# Altium schematic sheet Output.SchDoc: Output
size A4; Date: JUN 2020; ApprovedBy: Hören; CheckedBy: Mörz; Author: Rudziński; CompanyName: Semi-ATE; DrawnBy: Rudziński; Engineer: Hören; Organization: Semi-ATE; DocumentNumber: 10; Revision: V1.0; SheetNumber: 10; SheetTotal: 20
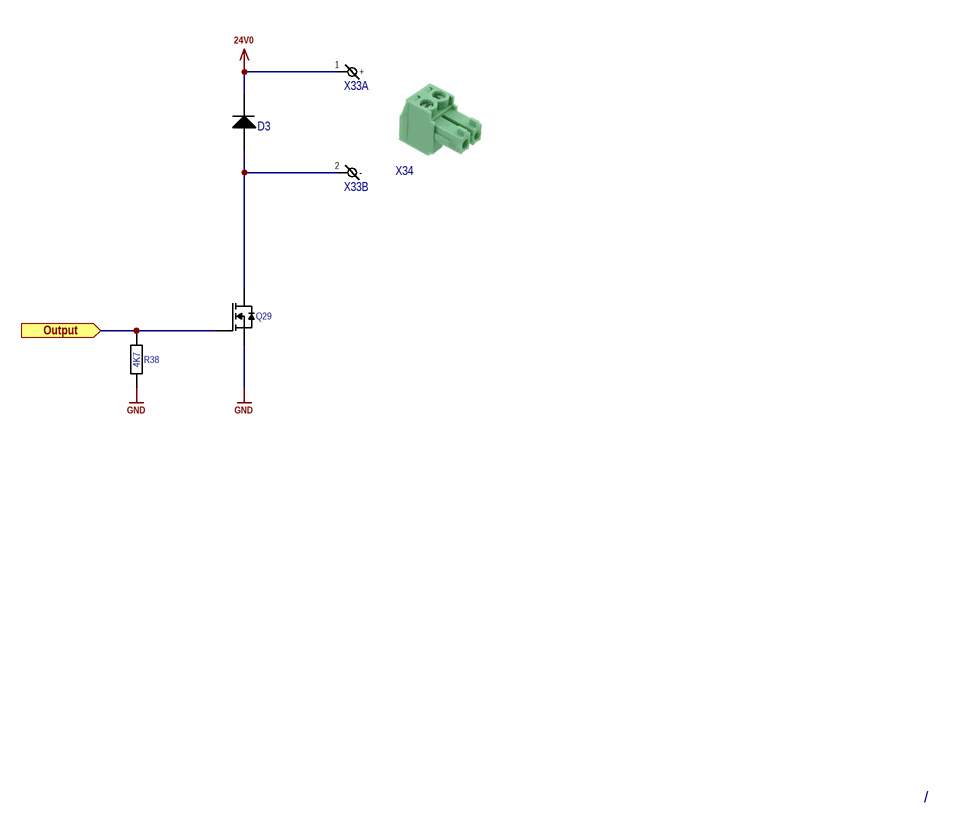
[diagram p0: Output.SchDoc]

## Parts
D3  D  [SOT23-3]  (value not drawn)
Q29  Q  [SOIC-8_MOSFET]  (value not drawn)
R38  value 4K7  [R0603 Reflow]  (hidden comment: R)
X33  X  [691322310002]  (value not drawn)  (parts A,B of 2)
X34  X  [691361300002]  (value not drawn)

## Ports
Output (in)

## Nets
24V0: D3.3(C) X33.1(+)
GND: Q29.2(S) R38.1
Output: Q29.1(G) R38.2 ; port Output
NetD3_1: D3.1(A) Q29.3(D) X33.2(-)

## Notes on the sheet
- /
- designed by
- reviewed by
- last drawn by
- Project:
- Schematic:
- last printed
- DIN-A4 L
- sheets
- of
- File:

## Library data of the parts
D3 = HSMS-2800-TR1G: DIODE SCHOTTKY 70V 70MA SOT23-3; 04. Manufacturer: ON Semiconductor; 07. Manufacturer  Part Number: BAS70LT1G; 03. Unit Price: 0.18; 13. Created Date/Name: AUG 2018 / Hören; 01. Distributor: DigiKey; 02. Distributor Part Number: BAS70LT1GOSCT-ND; ComponentLink1Description: Info; ComponentLink1URL: https://www.digikey.de/products/en/discrete-semiconductor-products/diodes-rf/284?k=HSMS-2800&k=&pkeyword=HSMS-2800&sv=0&pv7=243&sf=0&quantity=&ColumnSort=0&page=1&pageSize=25; ComponentLink2Description: DataSheet; ComponentLink2URL: https://docs.broadcom.com/docs/AV02-0533EN
Q29 = AO4266E: Transistor: N-MOSFET; unipolar; 60V; 8,5A; 2W; SO8; 04. Manufacturer: ALPHA & OMEGA SEMICONDUCTOR; 03. Unit Price: 0.242; 01. Distributor: TME; 02. Distributor Part Number: AO4266E; 07. Manufacturer  Part Number: AO4266E; 11. RoHS: YES; ComponentLink1Description: Info; ComponentLink1URL: https://www.digikey.de/product-detail/en/on-semiconductor/FDV303N/FDV303NDKR-ND/1630434; ComponentLink2Description: DataSheet; ComponentLink2URL: https://media.digikey.com/pdf/Data%20Sheets/Fairchild%20PDFs/FDV303N.pdf
R38 = R: RES SMD 4.7K OHM 1% 1/10W 0603; 04. Manufacturer: Yageo; 07. Manufacturer  Part Number: RC0603FR-074K7L; 03. Unit Price: 0.09; 13. Created Date/Name: AUG2018/Hören; Tolerance: ±1%; ComponentLink1URL: *; ComponentLink1Description: Info; 02. Distributor Part Number: 311-4.70KHRCT-ND; 09. Operating Temperature: -xx..+yy°C; 11. RoHS: ???; 01. Distributor: DigiKey; ComponentLink2Description: DataSheet; Package: *
X33 = 691322310002: TERM BLOCK HDR 2POS 90DEG 3.81MM; 04. Manufacturer: Würth Elektronik; 03. Unit Price: 0.32; 13. Created Date/Name: ??? / Hören; System: Connector; 01. Distributor: DigiKey; 02. Distributor Part Number: 732-2088-ND; 07. Manufacturer  Part Number: 691322310002; 11. RoHS: YES; ComponentLink1Description: Info; ComponentLink1URL: https://www.digikey.de/products/en?keywords=691322310002; ComponentLink2Description: DataSheet; ComponentLink2URL: https://media.digikey.com/pdf/Data%20Sheets/Wurth%20Electronics%20PDFs/Terminal%20Blocks%20WR-TBL.pdf
X34 = 691361300002: TERM BLOCK PLUG 2POS STR 3.81MM; 04. Manufacturer: Würth Elektronik; 03. Unit Price: 1.1; 13. Created Date/Name: ??? / Hören; System: Connector; 01. Distributor: DigiKey; 02. Distributor Part Number: 732-2076-ND; 07. Manufacturer  Part Number: 691361300002; ComponentLink1Description: Info; ComponentLink1URL: https://www.digikey.de/products/en?keywords=691361300002; ComponentLink2Description: DataSheet; ComponentLink2URL: https://media.digikey.com/pdf/Data%20Sheets/Wurth%20Electronics%20PDFs/Terminal%20Blocks%20WR-TBL.pdf